# EAGLE design v001 (EAGLE 6.4)
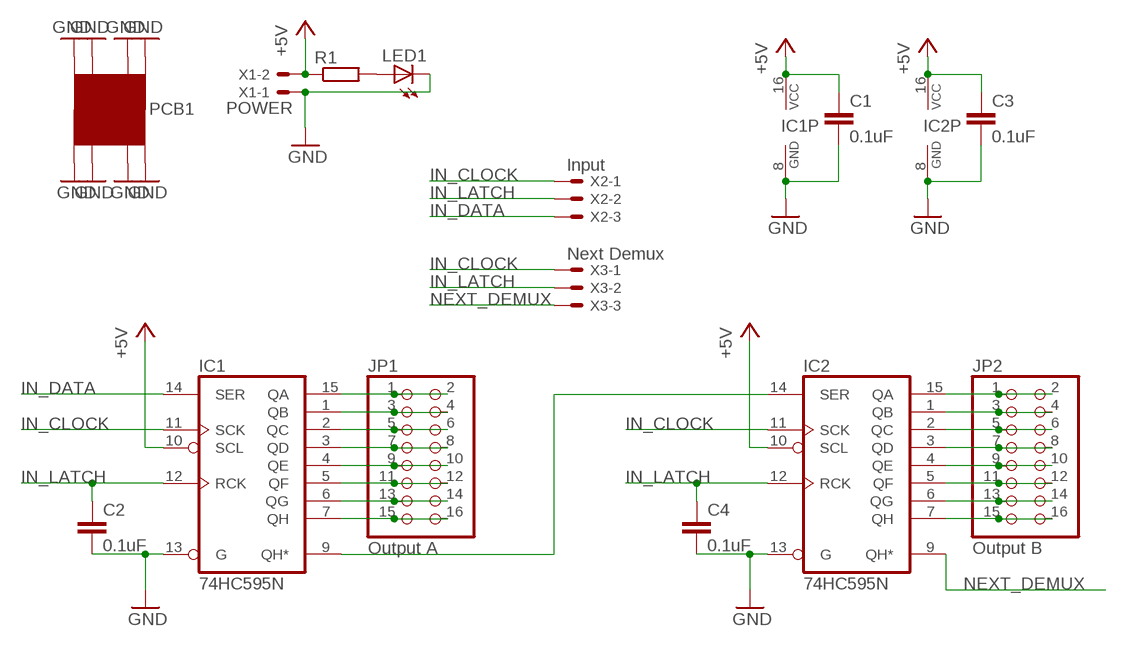
[diagram p0: schematic, sheet 1]

## Parts
C1  0.1uF  C-EU050-024X044  [C050-024X044]
C2  0.1uF  C-EU050-024X044  [C050-024X044]
C3  0.1uF  C-EU050-024X044  [C050-024X044]
C4  0.1uF  C-EU050-024X044  [C050-024X044]
IC1  74HC595N  [DIL16]
IC2  74HC595N  [DIL16]
JP1  Output A  PINHD-2X8  [2X08]
JP2  Output B  PINHD-2X8  [2X08]
LED1  LED3MM  [LED3MM]
PCB1  PCB05X05  [PCB_05X05]
R1  R-EU_0207/2V  [0207/2V]
X1  POWER  22-23-2021  [22-23-2021]
X2  Input  22-23-2031  [22-23-2031]
X3  Next Demux  22-23-2031  [22-23-2031]

## Nets
+5V: C1.1 C3.1 IC1.10(SCL) IC1.16(VCC) IC2.10(SCL) IC2.16(VCC) R1.1 X1.2
GND: C1.2 C2.2 C3.2 C4.2 IC1.8(GND) IC1.13(G) IC2.8(GND) IC2.13(G) LED1.K(C) PCB1.GND@1(GND) PCB1.GND@2(GND) PCB1.GND@3(GND) PCB1.GND@4(GND) PCB1.GND@5(GND) PCB1.GND@6(GND) PCB1.GND@7(GND) PCB1.GND@8(GND) X1.1
IN_CLOCK: IC1.11(SCK) IC2.11(SCK) X2.1 X3.1
IN_DATA: IC1.14(SER) X2.3
IN_LATCH: C2.1 C4.1 IC1.12(RCK) IC2.12(RCK) X2.2 X3.2
N$1: IC1.15(QA) JP1.1 JP1.2
N$2: IC1.1(QB) JP1.3 JP1.4
N$3: IC1.2(QC) JP1.5 JP1.6
N$4: IC1.3(QD) JP1.7 JP1.8
N$5: IC1.4(QE) JP1.9 JP1.10
N$6: IC1.5(QF) JP1.11 JP1.12
N$7: IC1.6(QG) JP1.13 JP1.14
N$8: IC1.7(QH) JP1.15 JP1.16
N$9: LED1.A R1.2
N$10: IC2.15(QA) JP2.1 JP2.2
N$11: IC2.1(QB) JP2.3 JP2.4
N$12: IC2.2(QC) JP2.5 JP2.6
N$13: IC2.3(QD) JP2.7 JP2.8
N$14: IC2.4(QE) JP2.9 JP2.10
N$15: IC2.5(QF) JP2.11 JP2.12
N$16: IC2.6(QG) JP2.13 JP2.14
N$17: IC2.7(QH) JP2.15 JP2.16
N$18: IC1.9(QH*) IC2.14(SER)
NEXT_DEMUX: IC2.9(QH*) X3.3

## Library data of the parts
C1-C4 = rcl:C-EU: CAPACITOR, European symbol
IC1 IC2 = 74xx-eu:74*595: 8-bit SHIFT REGISTER, output latch
JP1 JP2 = pinhead:PINHD-2X8: PIN HEADER
LED1 = led:LED: LED OSRAM: - CHIPLED LG R971, LG N971, LY N971, LG Q971, LY Q971, LO R971, LY R971 LH N974, LH R974 LS Q976, LO Q976, LY Q976 LO Q996 - Hyper CHIPLED LW Q18S LB Q993, LB Q99A, LB R99A - SideLED LS A670, LO A670, LY A670, LG A670, LP A670 LB A673, LV A673, LT A673, LW A673 LH A674 LY A675 LS A676, LA A676, LO A676, LY A676, LW A676 LS A679, LY A679, LG A679 - Hyper Micro SIDELED® LS Y876, LA Y876, LO Y876, LY Y876 LT Y87S - SmartLED LW L88C, LW L88S LB L89C, LB L89S, LG L890 LS L89K, LO L89K, LY L89K LS L896, LA L896, LO L896, LY L896 - TOPLED LS T670, LO T670, LY T670, LG T670, LP T670 LSG T670, LSP T670, LSY T670, LOP T670, LYG T670 LG T671, LOG T671, LSG T671 LB T673, LV T673, LT T673, LW T673 LH T674 LS T676, LA T676, LO T676, LY T676, LB T676, LH T676, LSB T676, LW T676 LB T67C, LV T67C, LT T67C, LS T67K, LO T67K, LY T67K, LW E67C LS E67B, LA E67B, LO E67B, LY E67B, LB E67C, LV E67C, LT E67C LW T67C LS T679, LY T679, LG T679 LS T770, LO T770, LY T770, LG T770, LP T770 LB T773, LV T773, LT T773, LW T773 LH T774 LS E675, LA E675, LY E675, LS T675 LS T776, LA T776, LO T776, LY T776, LB T776 LHGB T686 LT T68C, LB T68C - Hyper Mini TOPLED® LB M676 - Mini TOPLED Santana® LG M470 LS M47K, LO M47K, LY M47K Source: http://www.osram.convergy.de LUXEON: - LUMILED® LXK2-PW12-R00, LXK2-PW12-S00, LXK2-PW14-U00, LXK2-PW14-V00 LXK2-PM12-R00, LXK2-PM12-S00, LXK2-PM14-U00 LXK2-PE12-Q00, LXK2-PE12-R00, LXK2-PE12-S00, LXK2-PE14-T00, LXK2-PE14-U00 LXK2-PB12-K00, LXK2-PB12-L00, LXK2-PB12-M00, LXK2-PB14-N00, LXK2-PB14-P00, LXK2-PB14-Q00 LXK2-PR12-L00, LXK2-PR12-M00, LXK2-PR14-Q00, LXK2-PR14-R00 LXK2-PD12-Q00, LXK2-PD12-R00, LXK2-PD12-S00 LXK2-PH12-R00, LXK2-PH12-S00 LXK2-PL12-P00, LXK2-PL12-Q00, LXK2-PL12-R00 Source: www.luxeon.com KINGBRIGHT: KA-3528ASYC Source: www.kingbright.com
PCB1 = GNLib:PCB
R1 = resistor:R-EU_: RESISTOR, European symbol
X1 = con-molex:22-23-2021: .100" (2.54mm) Center Header - 2 Pin; MF: MOLEX; MPN: 22-23-2021; OC_FARNELL: 1462926; OC_NEWARK: 25C3832
X2 X3 = con-molex:22-23-2031: .100" (2.54mm) Center Header - 3 Pin; MF: MOLEX; MPN: 22-23-2031; OC_FARNELL: 1462950; OC_NEWARK: 30C0862

## Board
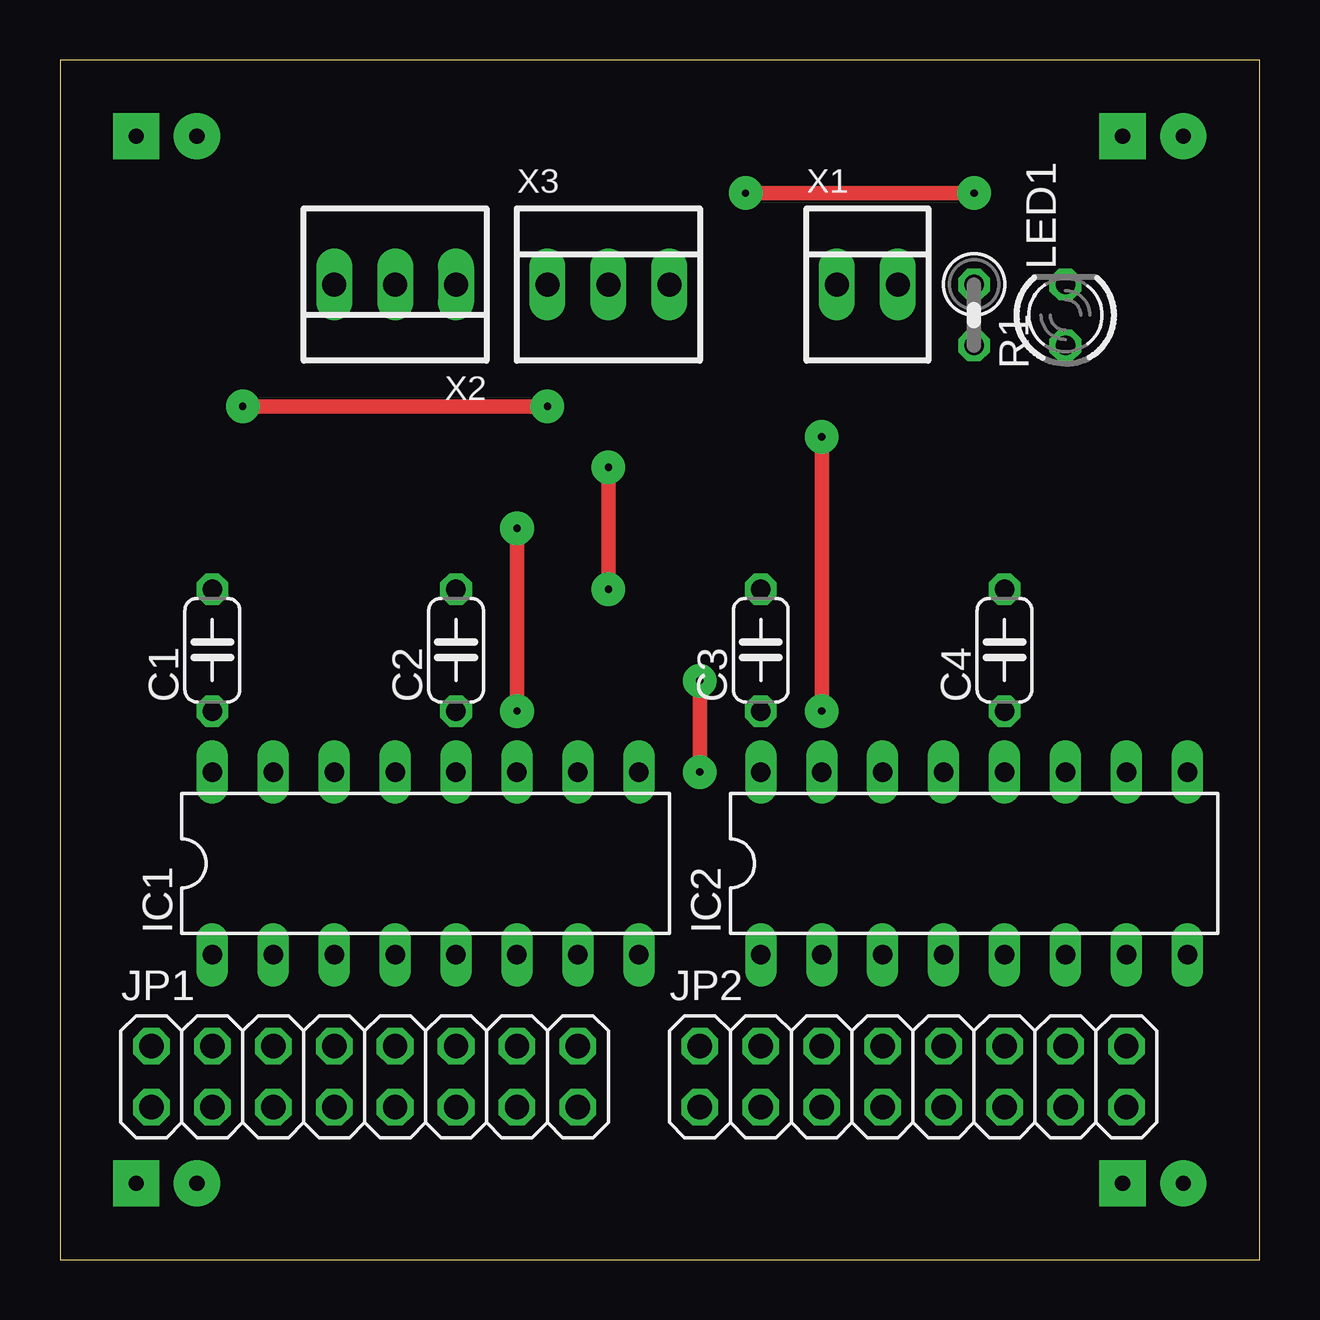
[diagram p1: board, top side]
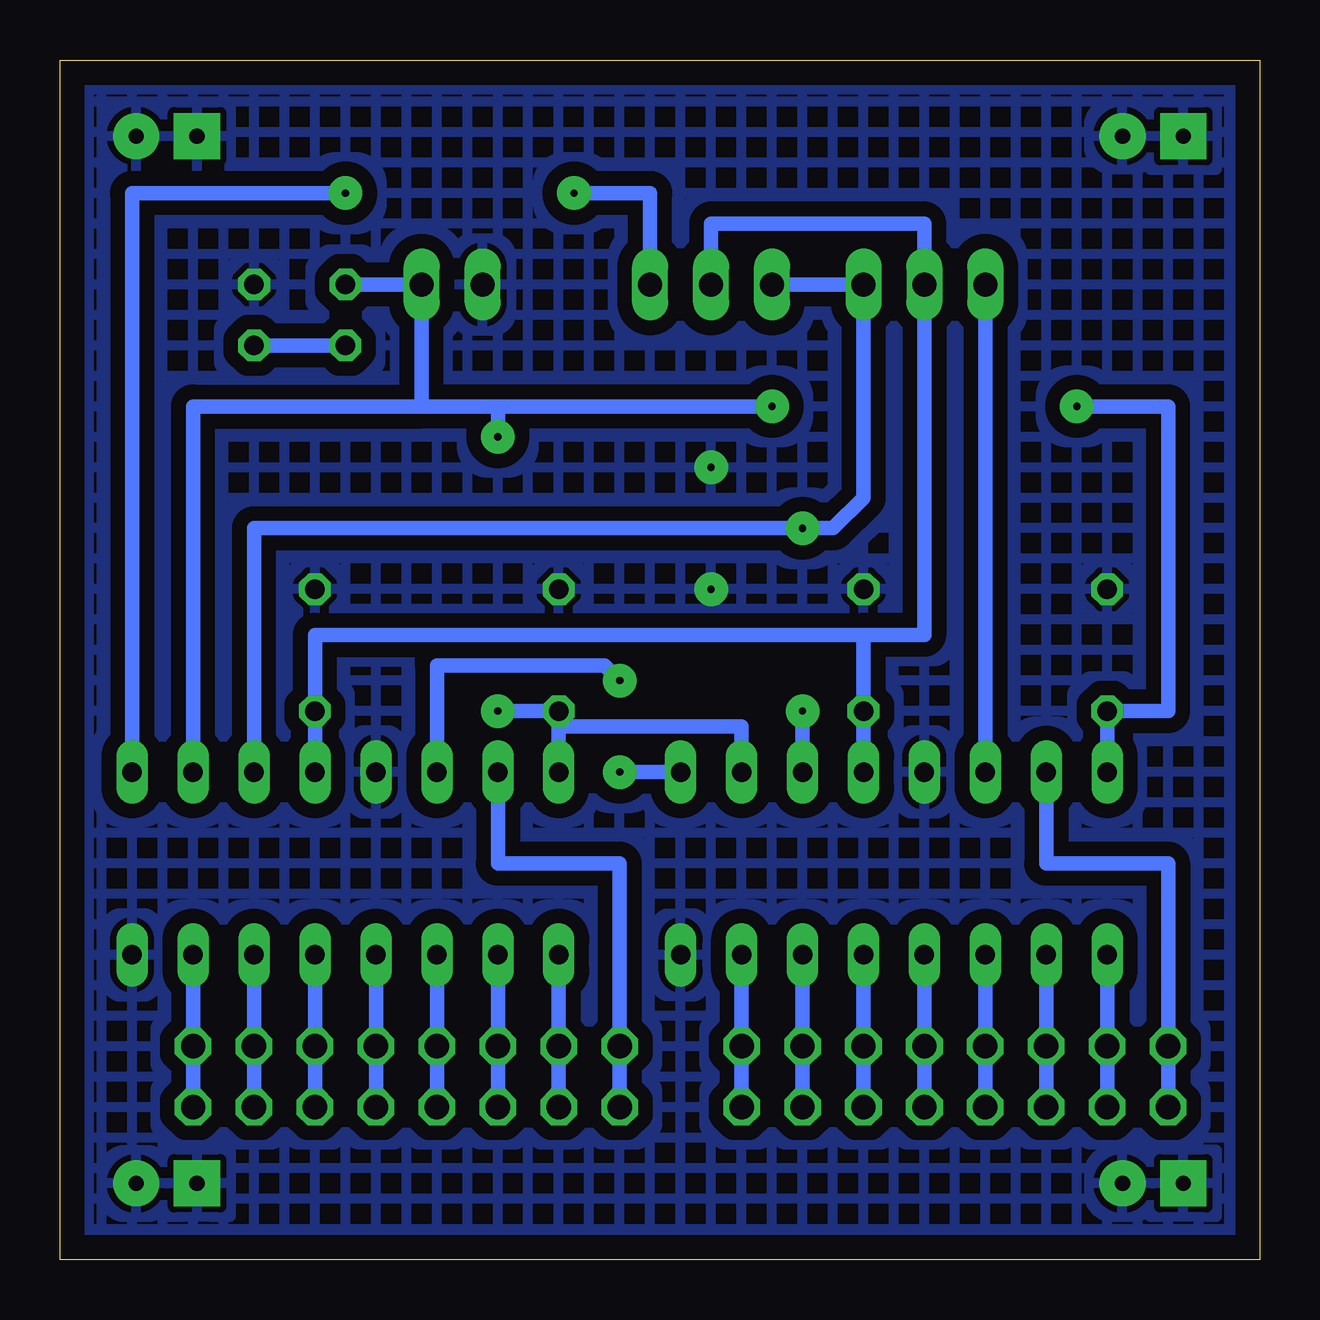
[diagram p2: board, bottom side, seen from below]

Size 50 x 50 mm. Coordinates in mm from the lower left corner, seen from the top.
Outline: 0,0 50,0 50,50 0,50 0,0
Copper layers (1*16): Top 0.035mm / dielectric 1.5mm / Bottom 0.035mm
Design rules "default": minimum track width 10mil, minimum drill 24mil, track to track 8mil, track to pad 8mil, pad to pad 8mil, via to via 8mil, smd to smd 8mil, copper to edge 40mil, drill to drill 8mil, minimum pad ring 10mil, minimum via ring 8mil, stop-mask expansion 4mil, vias tented up to drill 0mil, thermal gap 10mil

### Footprints (pad centres in the part's own frame; a part is rotated, then mirrored left to right if it is on the bottom)
C050-024X044 = drill 0.813 octagon: 1 -2.54,0; 2 2.54,0
DIL16 = drill 0.813 long: 1 -8.89,-3.81; 2 -6.35,-3.81; 3 -3.81,-3.81; 4 -1.27,-3.81; 5 1.27,-3.81; 6 3.81,-3.81; 7 6.35,-3.81; 8 8.89,-3.81; 9 8.89,3.81; 10 6.35,3.81; 11 3.81,3.81; 12 1.27,3.81; 13 -1.27,3.81; 14 -3.81,3.81; 15 -6.35,3.81; 16 -8.89,3.81
2X08 = drill 1.016 octagon: 1 -8.89,-1.27; 2 -8.89,1.27; 3 -6.35,-1.27; 4 -6.35,1.27; 5 -3.81,-1.27; 6 -3.81,1.27; 7 -1.27,-1.27; 8 -1.27,1.27; 9 1.27,-1.27; 10 1.27,1.27; 11 3.81,-1.27; 12 3.81,1.27; 13 6.35,-1.27; 14 6.35,1.27; 15 8.89,-1.27; 16 8.89,1.27
LED3MM = drill 0.813 octagon: A -1.27,0; K 1.27,0
PCB_05X05 = drill 0.64 pad 1.93 square: GND@1 3.175,46.825; GND@2 44.285,46.825; GND@7 3.175,3.175; GND@8 44.285,3.175 | drill 0.64 pad 1.93: GND@3 46.825,46.825; GND@4 5.715,46.825; GND@5 46.825,3.175; GND@6 5.715,3.175
0207/2V = drill 0.813 octagon: 1 -1.27,0; 2 1.27,0
22-23-2021 = drill 1 long: 1 -1.27,0; 2 1.27,0
22-23-2031 = drill 1 long: 1 -2.54,0; 2 0,0; 3 2.54,0

### Placement (x,y rotation side)
C1  6.35,25.4 90 top
C2  16.51,25.4 90 top
C3  29.21,25.4 90 top
C4  39.37,25.4 90 top
IC1  15.24,16.51 0 top
IC2  38.1,16.51 0 top
JP1  12.7,7.62 0 top
JP2  35.56,7.62 0 top
LED1  41.91,39.37 90 top
PCB1  0,0 0 top
R1  38.1,39.37 270 top
X1  33.66,40.64 0 top
X2  13.97,40.64 180 top
X3  22.86,40.64 0 top

### Tracks (layer width: path | path; a pad name or v marks a point on that pad's centre or on a via)
+5V  (via drill 0.3 pad 1.4)
  Top 0.61: v7.62,35.56 v20.32,35.56 | v31.75,22.86 v31.75,34.29
  Bottom 0.61: 29.21,22.23 C3.1 v31.75,22.86 | 29.21,22.23 IC2.16 | IC1.16 C1.1 3.81,22.86 3.81,35.56 v7.62,35.56 | v20.32,35.56 31.75,35.56 | 31.75,35.56 34.92,35.56 | 34.92,35.56 X1.2 R1.1 | v31.75,34.29 31.75,35.56 | IC2.10 44.45,35.56 34.92,35.56 | IC1.10 21.59,22.23 29.21,22.23
GND  (via drill 0.3 pad 1.4)
  Top 0.61: v22.86,27.94 v22.86,33.02
  pour Bottom (isolate 0.61, hatched): 0,50 50,50 50,0 0,0
IN_CLOCK  (via drill 0.3 pad 1.4)
  Top 0.61: v19.05,30.48 v19.05,22.86
  Bottom 0.61: v19.05,22.86 IC1.11 | IC2.11 41.91,30.48 v19.05,30.48 17.78,30.48 16.51,31.75 X2.1 X3.1
IN_DATA
  Bottom 0.61: X2.3 IC1.14
IN_LATCH
  Bottom 0.61: IC1.12 C2.1 16.51,26.04 | IC2.12 C4.1 39.37,26.04 16.51,26.04 | 16.51,26.04 13.97,26.04 X2.2 13.97,43.18 22.86,43.18 X3.2
N$1
  Bottom 0.61: JP1.1 JP1.2 3.81,16.51 8.89,16.51 IC1.15
N$2
  Bottom 0.61: IC1.1 JP1.4 JP1.3
N$3
  Bottom 0.61: IC1.2 JP1.6 JP1.5
N$4
  Bottom 0.61: IC1.3 JP1.8 JP1.7
N$5
  Bottom 0.61: IC1.4 JP1.10 JP1.9
N$6
  Bottom 0.61: IC1.5 JP1.12 JP1.11
N$7
  Bottom 0.61: IC1.6 JP1.14 JP1.13
N$8
  Bottom 0.61: IC1.7 JP1.16 JP1.15
N$9
  Bottom 0.61: R1.2 LED1.A
N$10
  Bottom 0.61: JP2.1 JP2.2 26.67,16.51 31.75,16.51 IC2.15
N$11
  Bottom 0.61: IC2.1 JP2.4 JP2.3
N$12
  Bottom 0.61: IC2.2 JP2.6 JP2.5
N$13
  Bottom 0.61: JP2.7 JP2.8 IC2.3
N$14
  Bottom 0.61: IC2.4 JP2.10 JP2.9
N$15
  Bottom 0.61: IC2.5 JP2.12 JP2.11
N$16
  Bottom 0.61: IC2.6 JP2.14 JP2.13
N$17
  Bottom 0.61: IC2.7 JP2.16 JP2.15
N$18  (via drill 0.3 pad 1.4)
  Top 0.61: v26.67,20.32 v26.67,24.13
  Bottom 0.61: IC1.9 v26.67,20.32 | IC2.14 34.29,24.77 27.3,24.77 v26.67,24.13
NEXT_DEMUX  (via drill 0.3 pad 1.4)
  Top 0.61: v28.57,44.45 v38.1,44.45
  Bottom 0.61: X3.3 25.4,44.45 v28.57,44.45 | IC2.9 46.99,44.45 v38.1,44.45